# Altium schematic sheet PDM-S01-V00-HarnessConnector.SchDoc: Harness Connectors
size A3; DrawnBy: Zoe Goodward; Organization: QUT Motorsport; Address1: O-120, Gardens Point; Address2: 2 George Street; Address3: Brisbane, QLD 4000; Address4: Australia; DocumentNumber: ####; Revision: 01; SheetNumber: 1; SheetTotal: 1; Version: 01; Project: Power Distribution Module 2020; PageSetup: Record=PageOptions|CenterHorizontal=True|CenterVertical=True|PrintScale=0.97|XCorrection=1.00|YCorrection=1.00|PrintKind=0|BorderSize=5000000|LeftOffset=0|BottomOffset=0|Orientation=2|PaperLength=1000|PaperWidth=1000|Scale=100|PaperSource=7|PrintQuality=-4|MediaType=1|DitherType=10|PaperKind=A4|PrintScaleMode=1
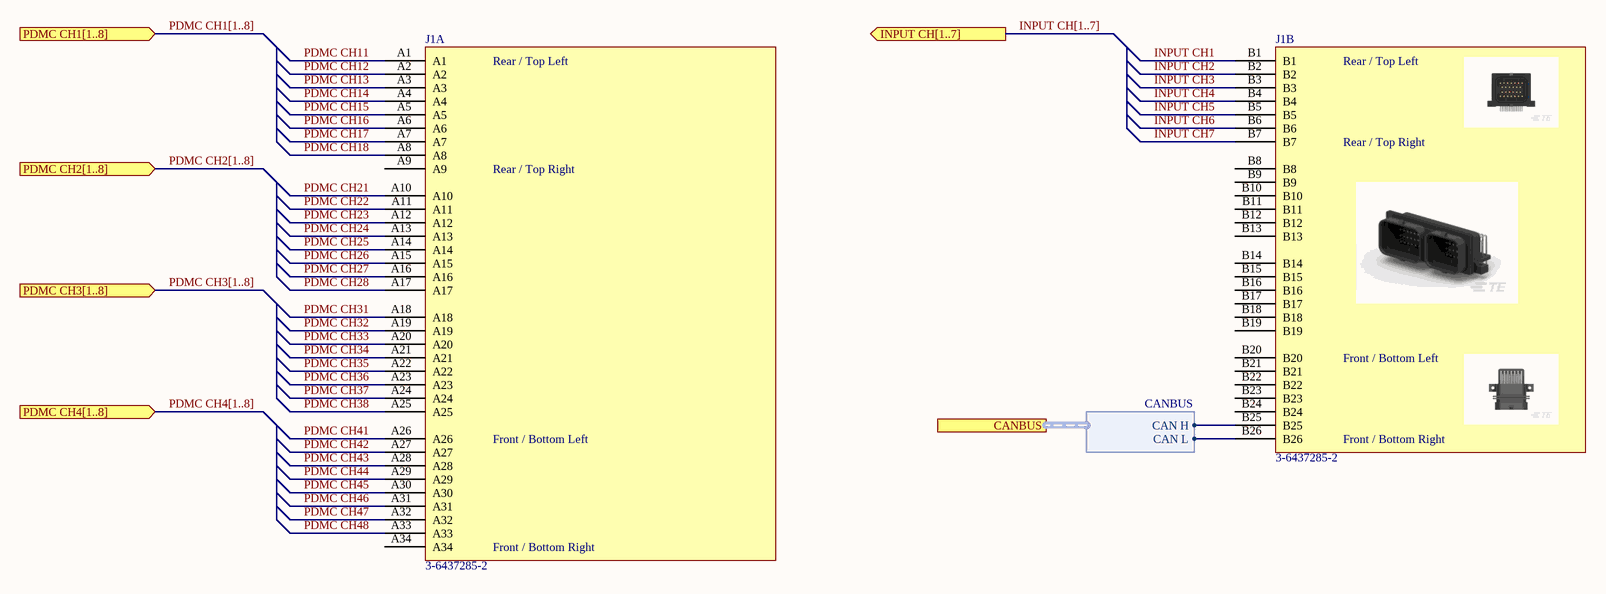
[diagram p0: PDM-S01-V00-HarnessConnector.SchDoc]

## Parts
J1  3-6437285-2  [SUPER SEAL RIGHT 60POS]  (parts A,B of 2)

## Ports
CANBUS (harness CANBUS), INPUT CH[1..7] (out), PDMC CH1[1..8] (in), PDMC CH2[1..8] (in), PDMC CH3[1..8] (in), PDMC CH4[1..8] (in)

## Harnesses
CANBUS: CAN H, CAN L

## Nets
INPUT CH1: J1.B1
INPUT CH2: J1.B2
INPUT CH3: J1.B3
INPUT CH4: J1.B4
INPUT CH5: J1.B5
INPUT CH6: J1.B6
INPUT CH7: J1.B7
PDMC CH11: J1.A1
PDMC CH12: J1.A2
PDMC CH13: J1.A3
PDMC CH14: J1.A4
PDMC CH15: J1.A5
PDMC CH16: J1.A6
PDMC CH17: J1.A7
PDMC CH18: J1.A8
PDMC CH21: J1.A10
PDMC CH22: J1.A11
PDMC CH23: J1.A12
PDMC CH24: J1.A13
PDMC CH25: J1.A14
PDMC CH26: J1.A15
PDMC CH27: J1.A16
PDMC CH28: J1.A17
PDMC CH31: J1.A18
PDMC CH32: J1.A19
PDMC CH33: J1.A20
PDMC CH34: J1.A21
PDMC CH35: J1.A22
PDMC CH36: J1.A23
PDMC CH37: J1.A24
PDMC CH38: J1.A25
PDMC CH41: J1.A26
PDMC CH42: J1.A27
PDMC CH43: J1.A28
PDMC CH44: J1.A29
PDMC CH45: J1.A30
PDMC CH46: J1.A31
PDMC CH47: J1.A32
PDMC CH48: J1.A33
NetJ1_B25: J1.B25 ; port CANBUS.CAN H
NetJ1_B26: J1.B26 ; port CANBUS.CAN L

Not connected (* = marked no-connect by the designer): J1 A9 A34 B8 B9 B10 B11 B12 B13 B14 B15 B16 B17 B18 B19 B20 B21 B22 B23 B24

## Buses and harness runs
bus INPUT CH[1..7] = port INPUT CH[1..7]
bus PDMC CH1[1..8] = port PDMC CH1[1..8]
bus PDMC CH2[1..8] = port PDMC CH2[1..8]
bus PDMC CH3[1..8] = port PDMC CH3[1..8]
bus PDMC CH4[1..8] = port PDMC CH4[1..8]

## Notes on the sheet
- Revision History:
- Sheet Title:
- Rev
- Date
- Description
- Project:
- Size:
- Drawn By:
- A3
- Number:
- Revision:
- Sheet
- Version:
- of
- QUT Motorsport
- O-120, Gardens Point
- 2 George Street
- Brisbane, QLD 4000
- Australia
- Print Date:
- Print Time:
- File Name:
- (in symbol 3-6437285-2, part A) Rear / Top Left; Rear / Top Right; Front / Bottom Left; Front / Bottom Right
- (in symbol 3-6437285-2, part B) Rear / Top Left; Rear / Top Right; Front / Bottom Left; Front / Bottom Right

## Library data of the parts
J1 = 3-6437285-2: Connector Header Through Hole, Right Angle 60 position 0.118" (3.00mm), 1.00mm contacts; ComponentLink1Description: Manufacturer; ComponentLink1URL: https://www.te.com/global-en/product-3-6437285-2.html